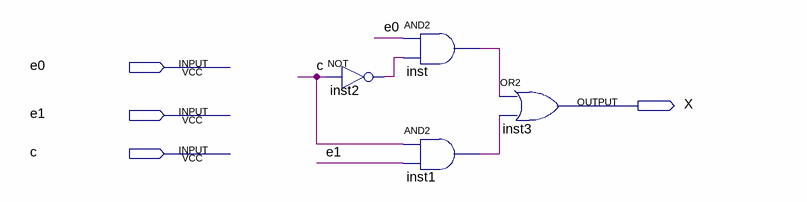
[diagram p0: schematic sheet]
// Quartus schematic mbr_mux2x1_1b.bdf as structural Verilog: 4 symbols, 4 pins
module mbr_mux2x1_1b (
  input  e0,
  input  e1,
  input  c,
  output X
);

  wire inst1_out, inst2_out, inst_out;

  not inst2 (inst2_out, c);
  and inst (inst_out, e0, inst2_out);
  and inst1 (inst1_out, c, e1);
  or inst3 (X, inst_out, inst1_out);
endmodule
